# EasyEDA schematic sch.json
TITLE: Sheet_1; REV: 1.0; Date: 2024-05-05; Sheet: 1/1; Drawn By: braydenzee; Company: Your Company
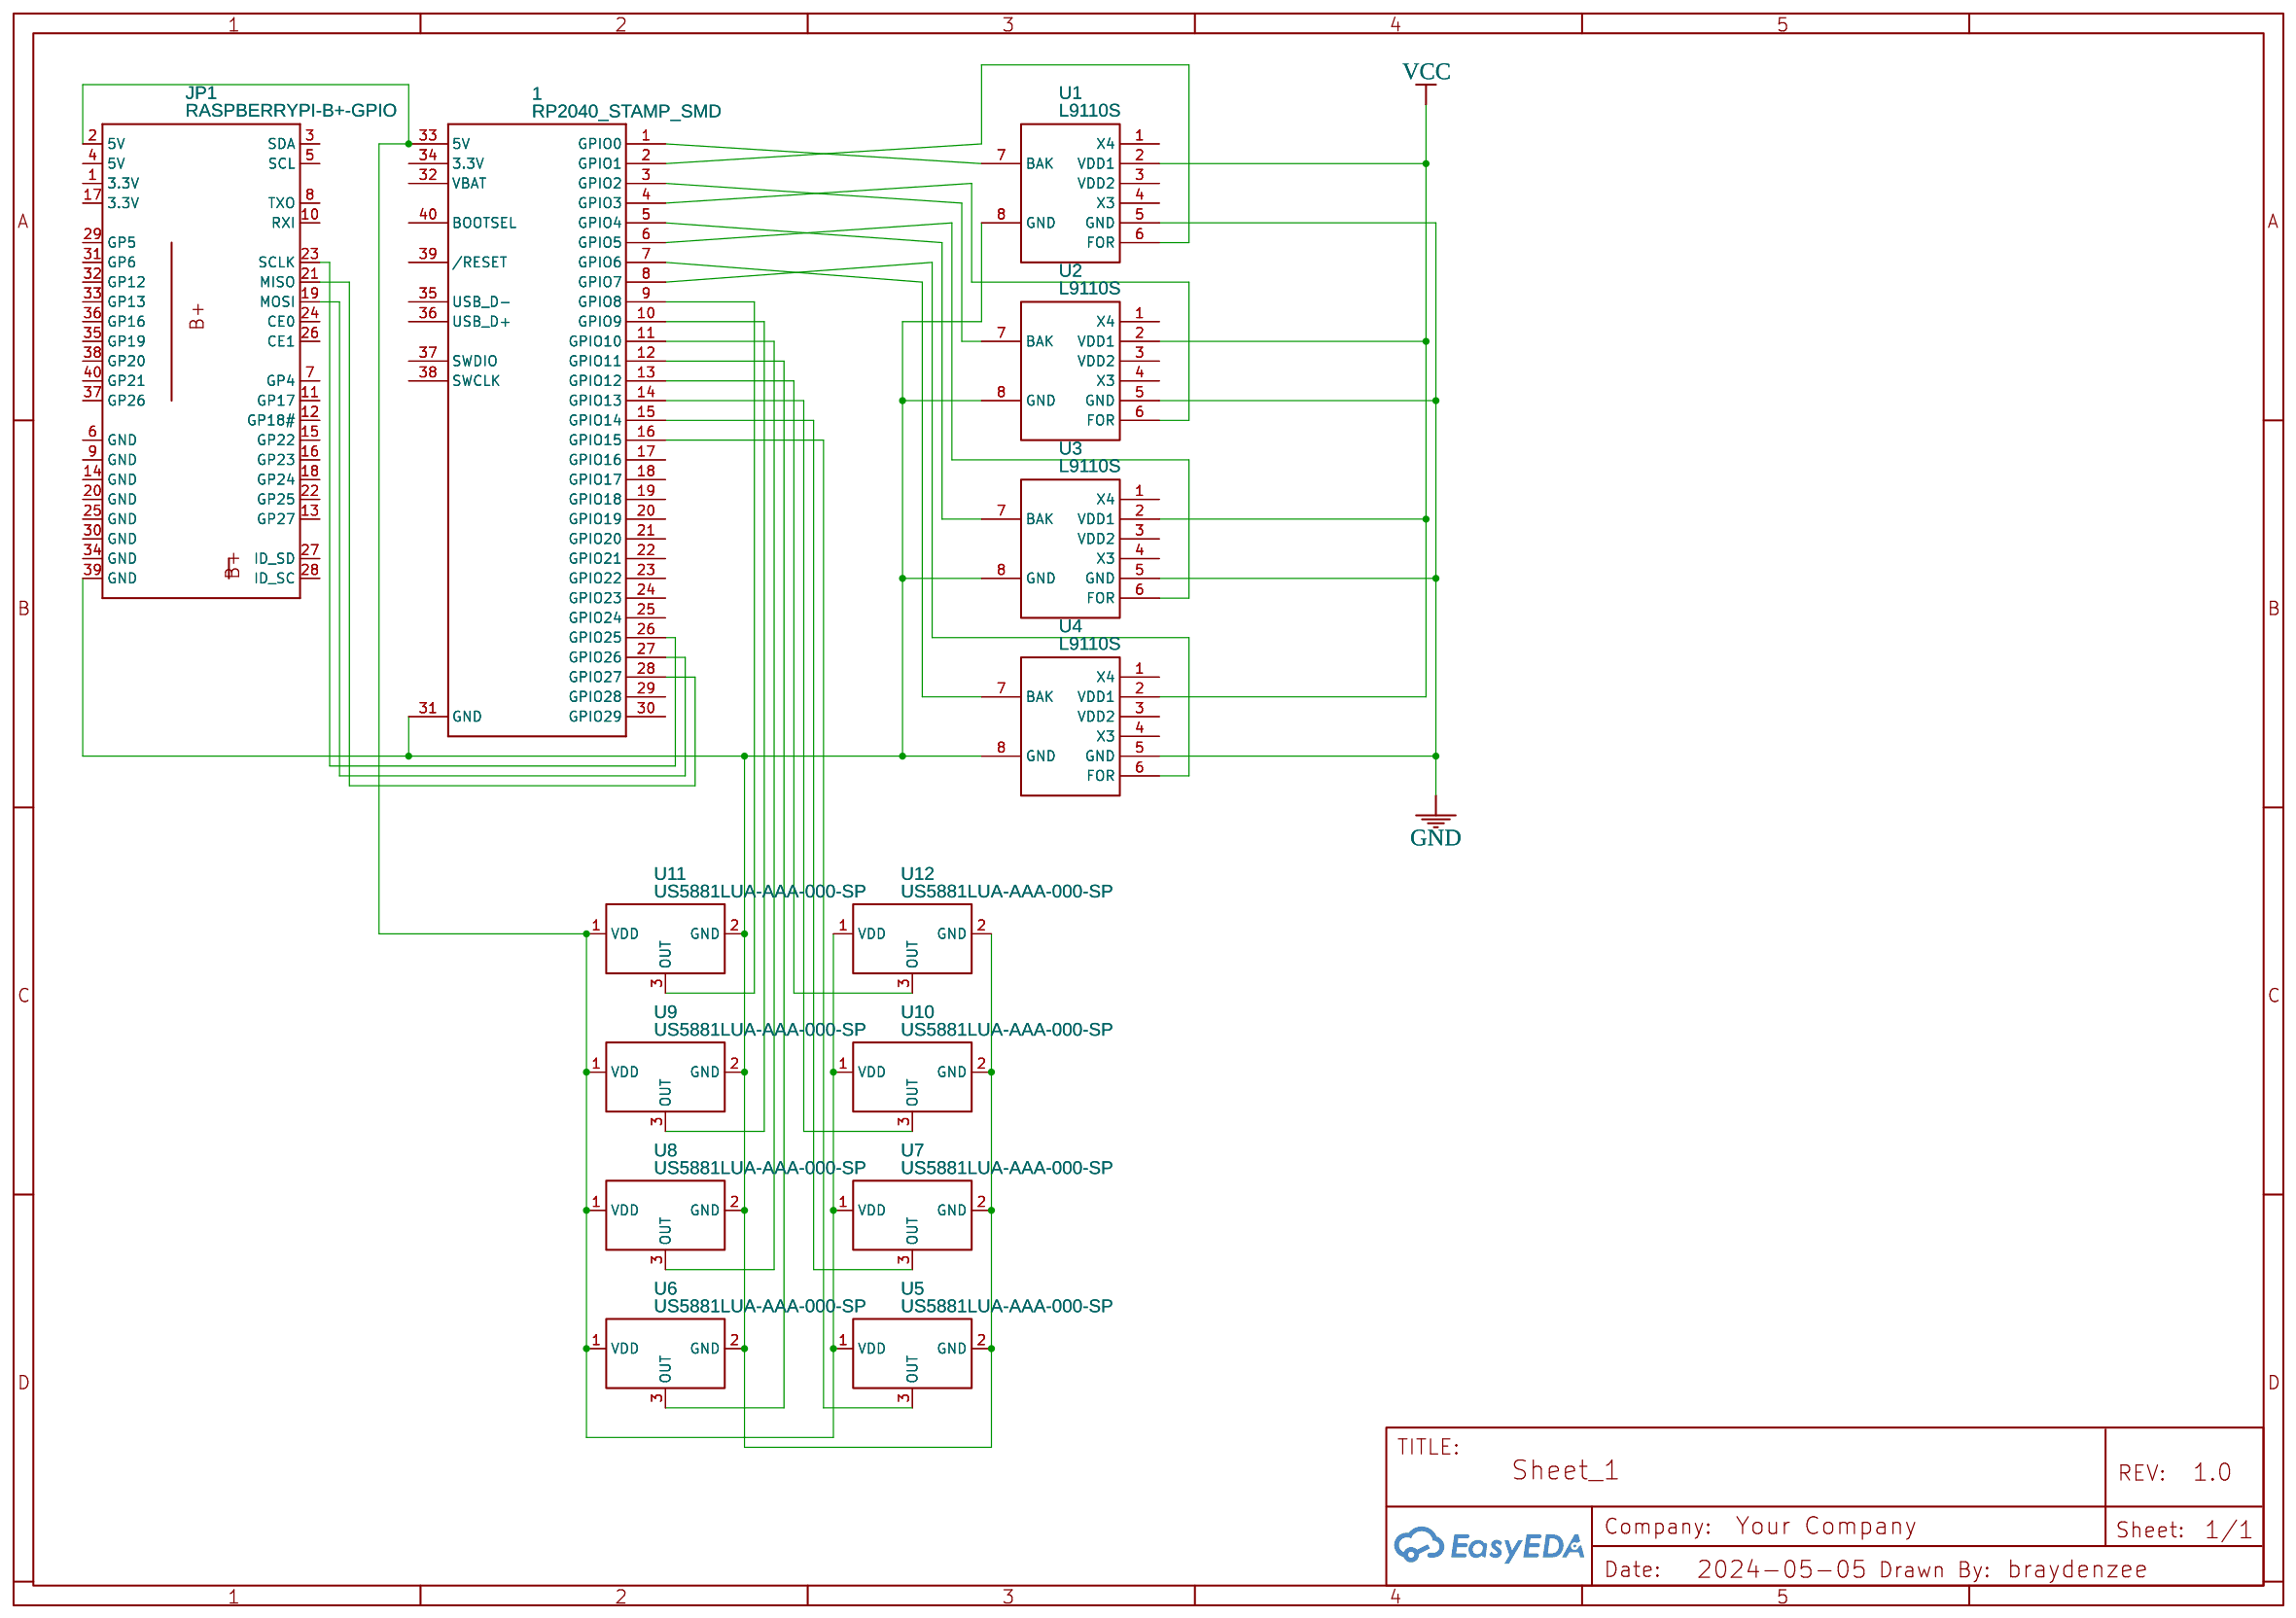
[diagram p0: schematic sheet]

## Parts
1  RP2040_STAMP_SMD  [RP2040_STAMP_SMD]
JP1  RASPBERRYPI-B+-GPIO  [2X20-SHROUDED]
U1  L9110S  [SOP-8_L4.9-W3.9-P1.27-LS6.0-BL]
U2  L9110S  [SOP-8_L4.9-W3.9-P1.27-LS6.0-BL]
U3  L9110S  [SOP-8_L4.9-W3.9-P1.27-LS6.0-BL]
U4  L9110S  [SOP-8_L4.9-W3.9-P1.27-LS6.0-BL]
U5  US5881LUA-AAA-000-SP  [TO-92-3_L4.1-W1.6-P1.27-L]
U6  US5881LUA-AAA-000-SP  [TO-92-3_L4.1-W1.6-P1.27-L]
U7  US5881LUA-AAA-000-SP  [TO-92-3_L4.1-W1.6-P1.27-L]
U8  US5881LUA-AAA-000-SP  [TO-92-3_L4.1-W1.6-P1.27-L]
U9  US5881LUA-AAA-000-SP  [TO-92-3_L4.1-W1.6-P1.27-L]
U10  US5881LUA-AAA-000-SP  [TO-92-3_L4.1-W1.6-P1.27-L]
U11  US5881LUA-AAA-000-SP  [TO-92-3_L4.1-W1.6-P1.27-L]
U12  US5881LUA-AAA-000-SP  [TO-92-3_L4.1-W1.6-P1.27-L]

## Library data of the parts
1 = RP2040_STAMP_SMD: Contributor: arturo182
JP1 = RASPBERRYPI-B+-GPIO: Raspberry Pi B+ GPIO Header; Contributor: SparkFun
U1-U4 = L9110S: Supplier: LCSC; Manufacturer: I-CORE(中微爱芯); Supplier Part: C85174; JLCPCB Part Class: Extended Part
U5-U12 = US5881LUA-AAA-000-SP: Supplier: LCSC; Supplier Part: C17682028; Manufacturer: Melexis(比利时迈来芯); Contributor: lcsc

## Nets
GND: U1.5(GND) U2.5(GND) U3.5(GND) U4.5(GND)
VCC: U1.2(VDD1) U2.2(VDD1) U3.2(VDD1) U4.2(VDD1)
Net-(1-1): 1.1(GPIO0) U1.7(BAK)
Net-(1-2): 1.2(GPIO1) U1.6(FOR)
Net-(1-3): 1.3(GPIO2) U2.7(BAK)
Net-(1-4): 1.4(GPIO3) U2.6(FOR)
Net-(1-5): 1.5(GPIO4) U3.7(BAK)
Net-(1-6): 1.6(GPIO5) U3.6(FOR)
Net-(1-7): 1.7(GPIO6) U4.7(BAK)
Net-(1-8): 1.8(GPIO7) U4.6(FOR)
Net-(1-9): 1.9(GPIO8) U11.3(OUT)
Net-(1-10): 1.10(GPIO9) U9.3(OUT)
Net-(1-11): 1.11(GPIO10) U8.3(OUT)
Net-(1-12): 1.12(GPIO11) U6.3(OUT)
Net-(1-13): 1.13(GPIO12) U12.3(OUT)
Net-(1-14): 1.14(GPIO13) U10.3(OUT)
Net-(1-15): 1.15(GPIO14) U7.3(OUT)
Net-(1-16): 1.16(GPIO15) U5.3(OUT)
Net-(1-26): 1.26(GPIO25) JP1.23(SCLK)
Net-(1-27): 1.27(GPIO26) JP1.19(MOSI)
Net-(1-28): 1.28(GPIO27) JP1.21(MISO)
Net-(1-31): 1.31(GND) JP1.39(GND) U1.8(GND) U2.8(GND) U3.8(GND) U4.8(GND) U5.2(GND) U6.2(GND) U7.2(GND) U8.2(GND) U9.2(GND) U10.2(GND) U11.2(GND) U12.2(GND)
Net-(1-33): 1.33(5V) JP1.2(5V) U5.1(VDD) U6.1(VDD) U7.1(VDD) U8.1(VDD) U9.1(VDD) U10.1(VDD) U11.1(VDD) U12.1(VDD)

Not connected (* = marked no-connect by the designer): 1 17(GPIO16) 18(GPIO17) 19(GPIO18) 20(GPIO19) 21(GPIO20) 22(GPIO21) 23(GPIO22) 24(GPIO23) 25(GPIO24) 29(GPIO28) 30(GPIO29) 32(VBAT) 34(3.3V) 35(USB_D-) 36(USB_D+) 37(SWDIO) 38(SWCLK) 39(/RESET) 40(BOOTSEL); JP1 1(3.3V) 3(SDA) 4(5V) 5(SCL) 6(GND) 7(GP4) 8(TXO) 9(GND) 10(RXI) 11(GP17) 12(GP18#) 13(GP27) 14(GND) 15(GP22) 16(GP23) 17(3.3V) 18(GP24) 20(GND) 22(GP25) 24(CE0) 25(GND) 26(CE1) 27(ID_SD) 28(ID_SC) 29(GP5) 30(GND) 31(GP6) 32(GP12) 33(GP13) 34(GND) 35(GP19) 36(GP16) 37(GP26) 38(GP20) 40(GP21); U1 1(X4) 3(VDD2) 4(X3); U2 1(X4) 3(VDD2) 4(X3); U3 1(X4) 3(VDD2) 4(X3); U4 1(X4) 3(VDD2) 4(X3)
